# EAGLE schematic Overall_Circuit (EAGLE 9.6.2)
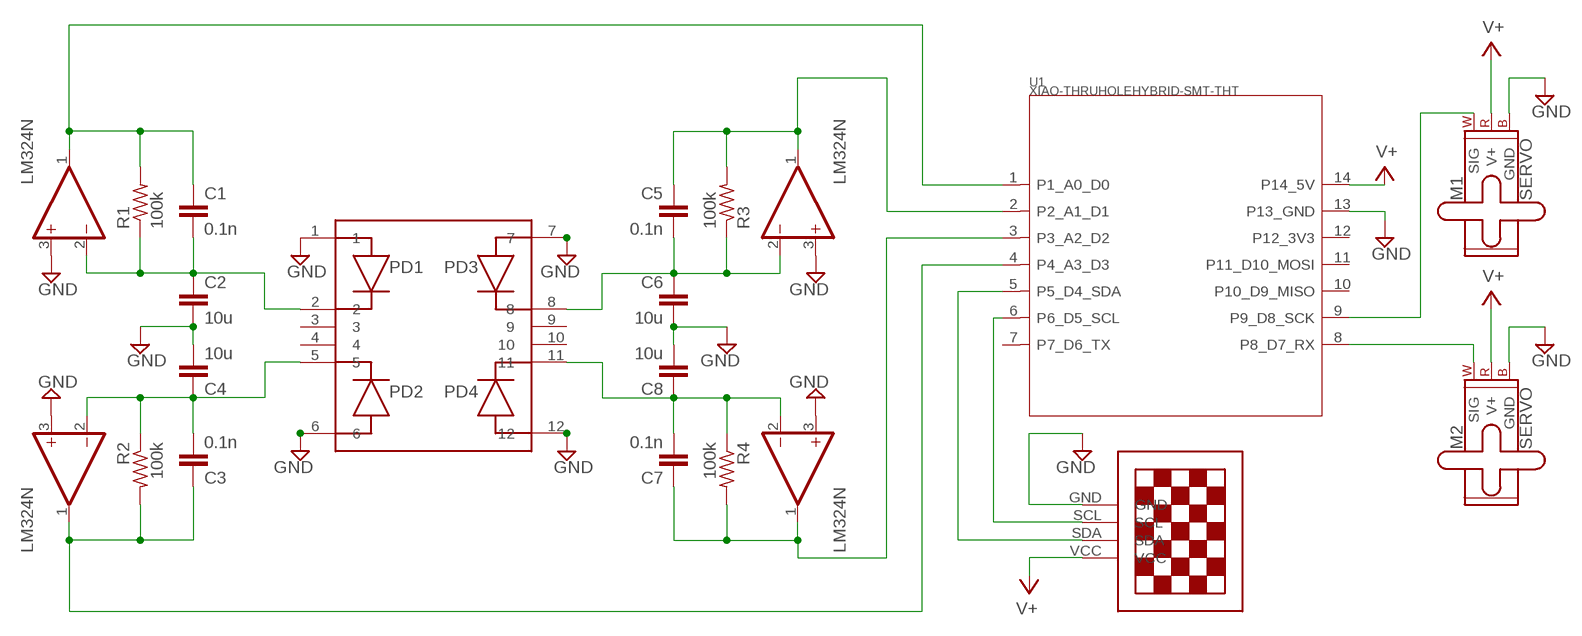
[diagram p0: schematic, sheet 1]

## Parts
C1  0.1n  C-EUC0805  [C0805]
C2  10u  C-EUC0805  [C0805]
C3  0.1n  C-EUC0805  [C0805]
C4  10u  C-EUC0805  [C0805]
C5  0.1n  C-EUC0805  [C0805]
C6  10u  C-EUC0805  [C0805]
C7  0.1n  C-EUC0805  [C0805]
C8  10u  C-EUC0805  [C0805]
IC1  LM324N  [DIL14]
IC2  LM324N  [DIL14]
IC3  LM324N  [DIL14]
IC4  LM324N  [DIL14]
M1  SERVO  [1X03]
M2  SERVO  [1X03]
R1  100k  R-US_R0805  [R0805]
R2  100k  R-US_R0805  [R0805]
R3  100k  R-US_R0805  [R0805]
R4  100k  R-US_R0805  [R0805]
U1  XIAO-THRUHOLEHYBRID-SMT-THT  [XIAO-GENERIC-HYBRID-MODULE14P-2.54-21X17.8MM]
U$1  OPR5925  [OPR5925]
U$2  13"OLED13"OLED  [1.3"OLED]

## Nets
GND: C2.2 C4.2 C6.2 C8.2 IC1.3(A:+IN) IC2.3(A:+IN) IC3.3(A:+IN) IC4.3(A:+IN) M1.3(GND) M2.3(GND) U1.13(P13_GND) U$1.1 U$1.6 U$1.7 U$1.12 U$2.GND
N$1: C1.2 C2.1 IC1.2(A:-IN) R1.1 U$1.2
N$2: C1.1 IC1.1(A:OUT) R1.2 U1.1(P1_A0_D0)
N$3: C3.2 C4.1 IC2.2(A:-IN) R2.1 U$1.5
N$4: C3.1 IC2.1(A:OUT) R2.2 U1.4(P4_A3_D3)
N$5: C5.2 C6.1 IC3.2(A:-IN) R3.1 U$1.8
N$6: C5.1 IC3.1(A:OUT) R3.2 U1.2(P2_A1_D1)
N$7: C7.2 C8.1 IC4.2(A:-IN) R4.1 U$1.11
N$8: C7.1 IC4.1(A:OUT) R4.2 U1.3(P3_A2_D2)
N$9: U1.6(P6_D5_SCL) U$2.SCL
N$10: M1.1(SIG) U1.9(P9_D8_SCK)
N$11: M2.1(SIG) U1.8(P8_D7_RX)
N$12: U1.5(P5_D4_SDA) U$2.SDA
V+: M1.2(V+) M2.2(V+) U1.14(P14_5V) U$2.VCC
Unconnected: IC1.5(B:+IN) IC1.6(B:-IN) IC1.7(B:OUT) IC1.8(C:OUT) IC1.9(C:-IN) IC1.10(C:+IN) IC1.12(D:+IN) IC1.13(D:-IN) IC1.14(D:OUT) IC2.5(B:+IN) IC2.6(B:-IN) IC2.7(B:OUT) IC2.8(C:OUT) IC2.9(C:-IN) IC2.10(C:+IN) IC2.12(D:+IN) IC2.13(D:-IN) IC2.14(D:OUT) IC3.5(B:+IN) IC3.6(B:-IN) IC3.7(B:OUT) IC3.8(C:OUT) IC3.9(C:-IN) IC3.10(C:+IN) IC3.12(D:+IN) IC3.13(D:-IN) IC3.14(D:OUT) IC4.5(B:+IN) IC4.6(B:-IN) IC4.7(B:OUT) IC4.8(C:OUT) IC4.9(C:-IN) IC4.10(C:+IN) IC4.12(D:+IN) IC4.13(D:-IN) IC4.14(D:OUT) U1.7(P7_D6_TX) U1.10(P10_D9_MISO) U1.11(P11_D10_MOSI) U1.12(P12_3V3) U$1.3 U$1.4 U$1.9 U$1.10

## Power pins joined to a net without a drawn wire
V+: IC1.4(P:V+) IC2.4(P:V+) IC3.4(P:V+) IC4.4(P:V+)
V-: IC1.11(P:V-) IC2.11(P:V-) IC3.11(P:V-) IC4.11(P:V-)

## Library data of the parts
C1-C8 = rcl:C-EU: CAPACITOR, European symbol; SPICEPREFIX: C
IC1-IC4 = linear:LM324: OP AMP
M1 M2 = SparkFun-Electromechanical:SERVO: Servo Motor 3-pin connector for a standard servo motor (voltage supply, ground, and control signal.) SparkFun Products Servo - Generic (Sub-Micro Size) <https://www.sparkfun.com/products/9065> (ROB-09065) Servo - Generic High Torque Continuous Rotation (Standard Size) <https://www.sparkfun.com/products/9347> (ROB-09347) Servo - Generic High Torque (Standard Size) <https://www.sparkfun.com/products/11965> (ROB-11965)
R1-R4 = resistor:R-US_: RESISTOR, American symbol
U1 = Seeed Studio XIAO Series:XIAO-THRUHOLE: Seeed Studio XIAO Series Through-hole Footprint and Symbol Basic through-hole footprint for Seeed XIAO series of boards. The underside surface mount pads are disabled. For through-hole mounting, a pair of 7-pin, 2.54mm pitch headers with 0.64x0.64mm square leads are recommended. The hybrid variant allows the assembler to choose between surface mount and through-hole mounting methods. However, there is a risk of solder leakage and therefore insufficient solder at the joints if soldering using solder paste and stencils, so we advise using this footprint only when the module is intended to be hand soldered. The symbol pin labels are generic. Please refer to the specific board for more information. Seeed Studio XIAO SAMD21 (Seeeduino XIAO) is also available pre-soldered: Seeed Studio XIAO SAMD21 Pre-soldered - Microchip ATSAMD21G18 Arduino Microcontroller with headers Seeed SKU: 102010388 Buy now <https://www.seeedstudio.com/Seeeduino-XIAO-Pre-Soldered-p-4747.html>
U$1 = OPR5925:OPR5925
U$2 = 13oled:13"OLED